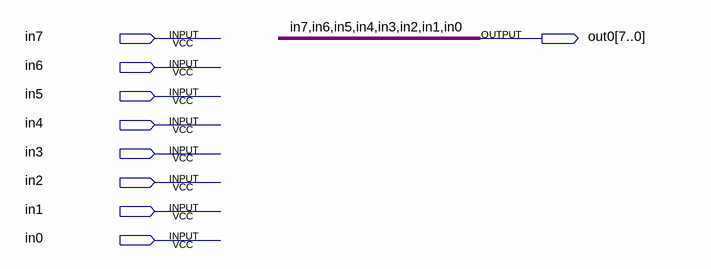
[diagram p0: schematic sheet]
// Quartus schematic 1x8to8x1.bdf as structural Verilog: 0 symbols, 9 pins
module \1x8to8x1  (
  input  in7,
  input  in6,
  input  in5,
  input  in4,
  input  in3,
  input  in2,
  input  in1,
  input  in0,
  output [7:0] out0
);


  assign out0 = {in7, in6, in5, in4, in3, in2, in1, in0};
endmodule
